# EAGLE board cyclops (EAGLE 8.3.2), part 1 of 2
PCB: Cyclops r3.1; REVISION: 3.1
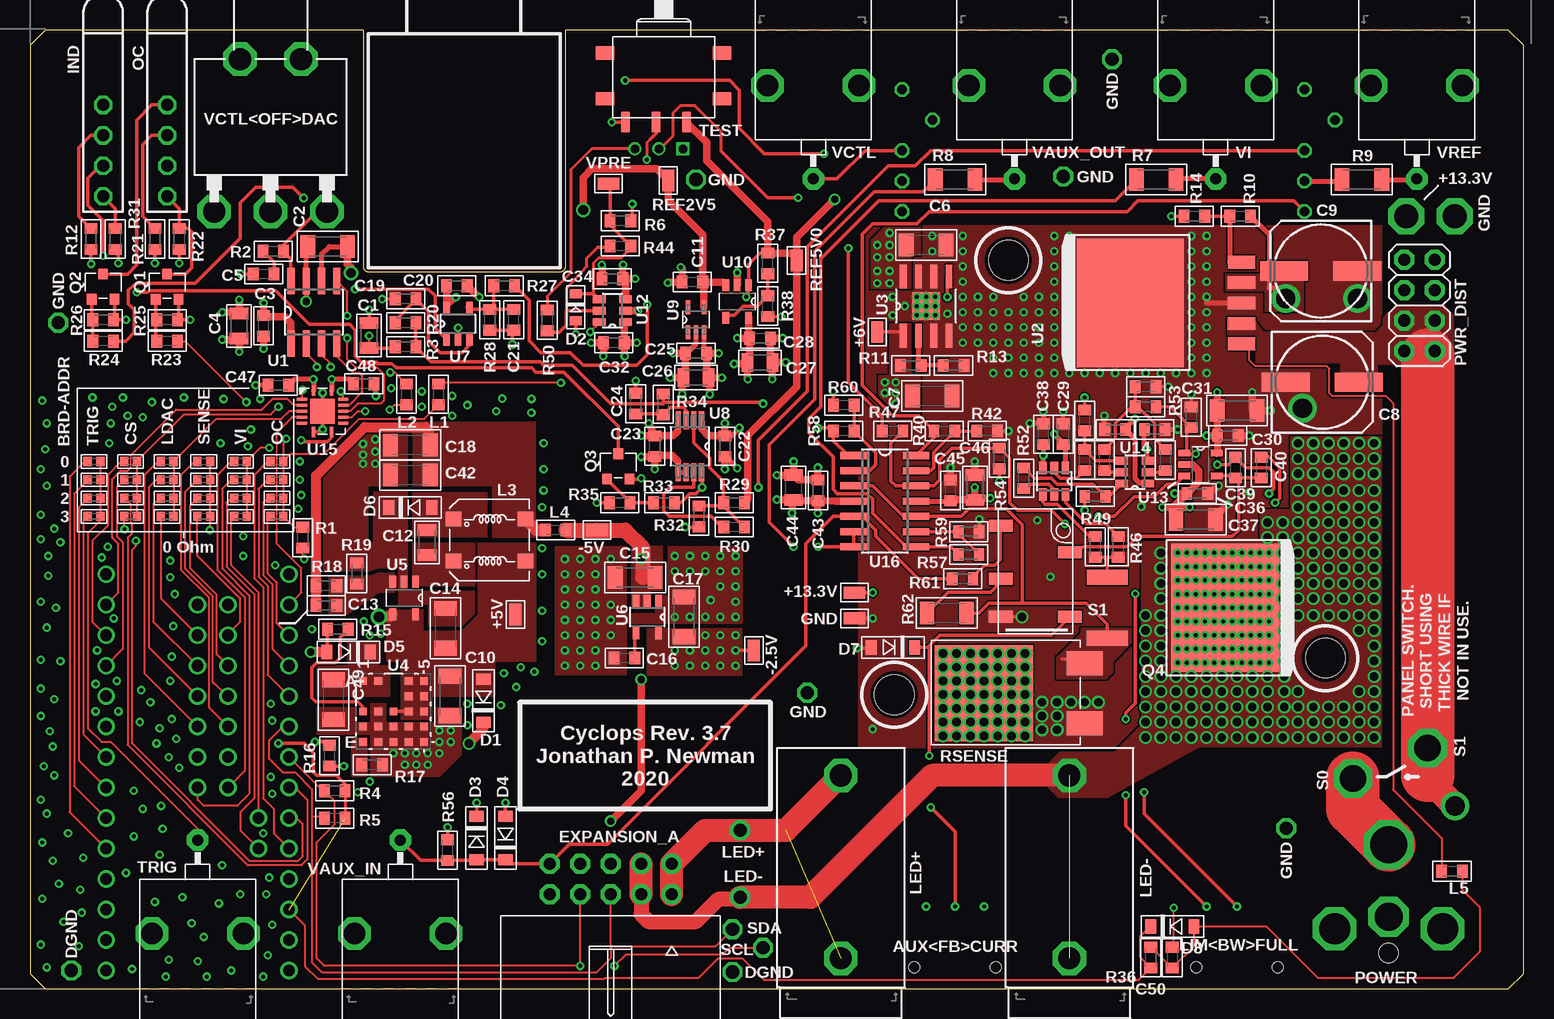
[diagram p5: board, top side]
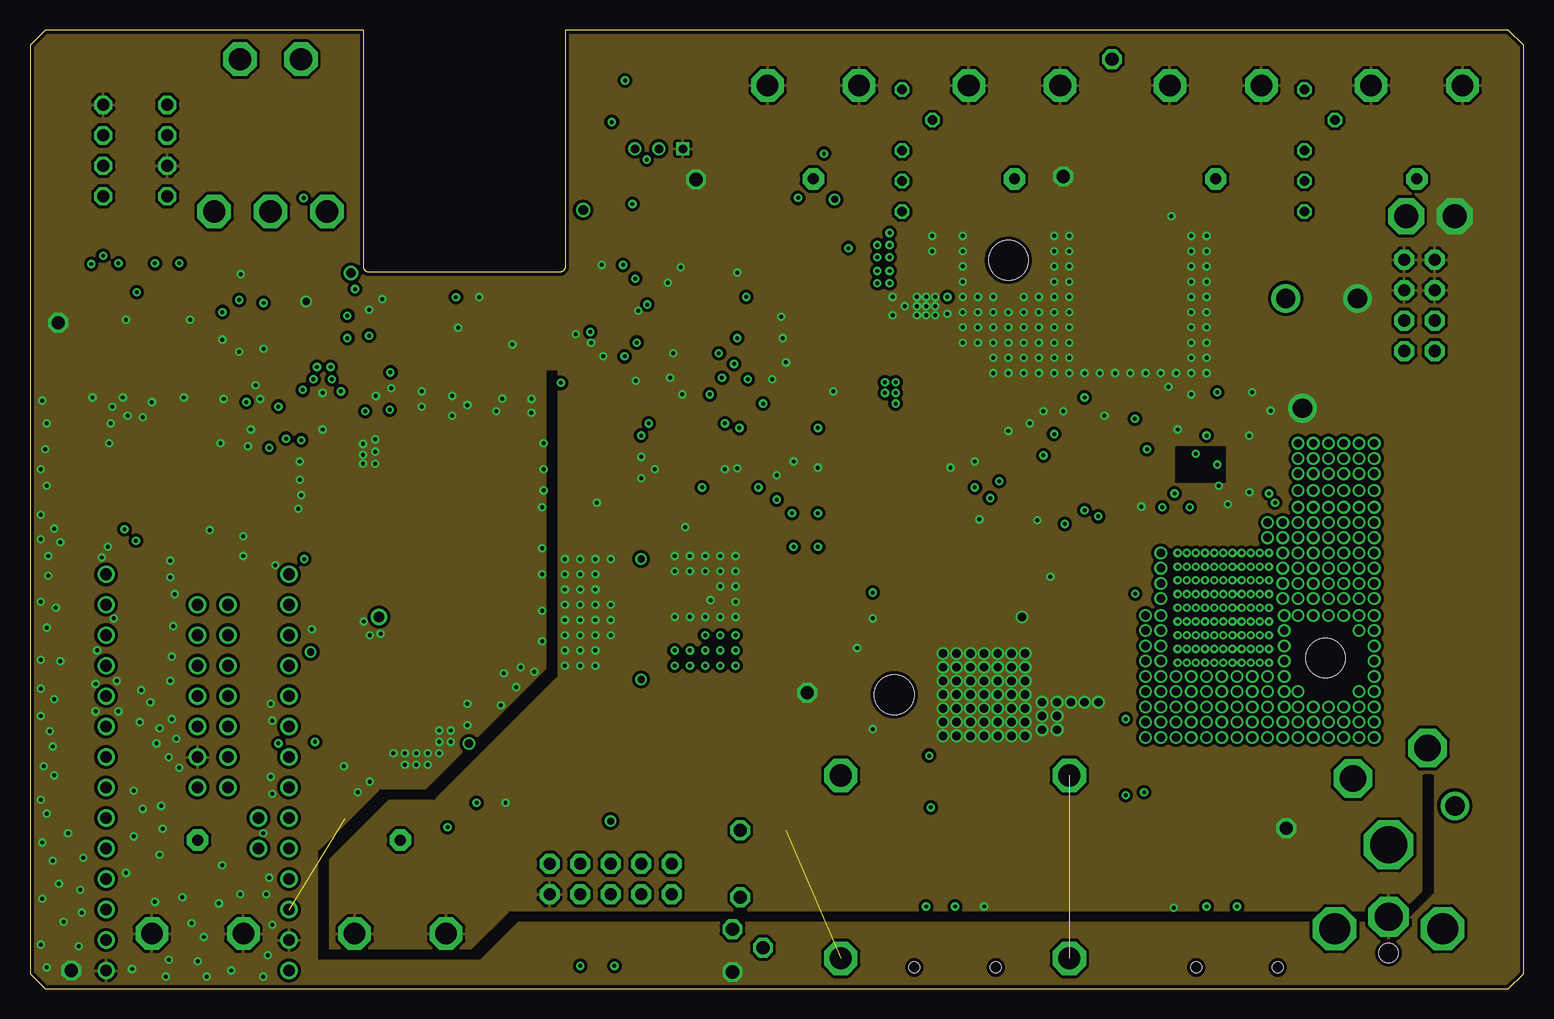
[diagram p6: board, inner layer Route2]
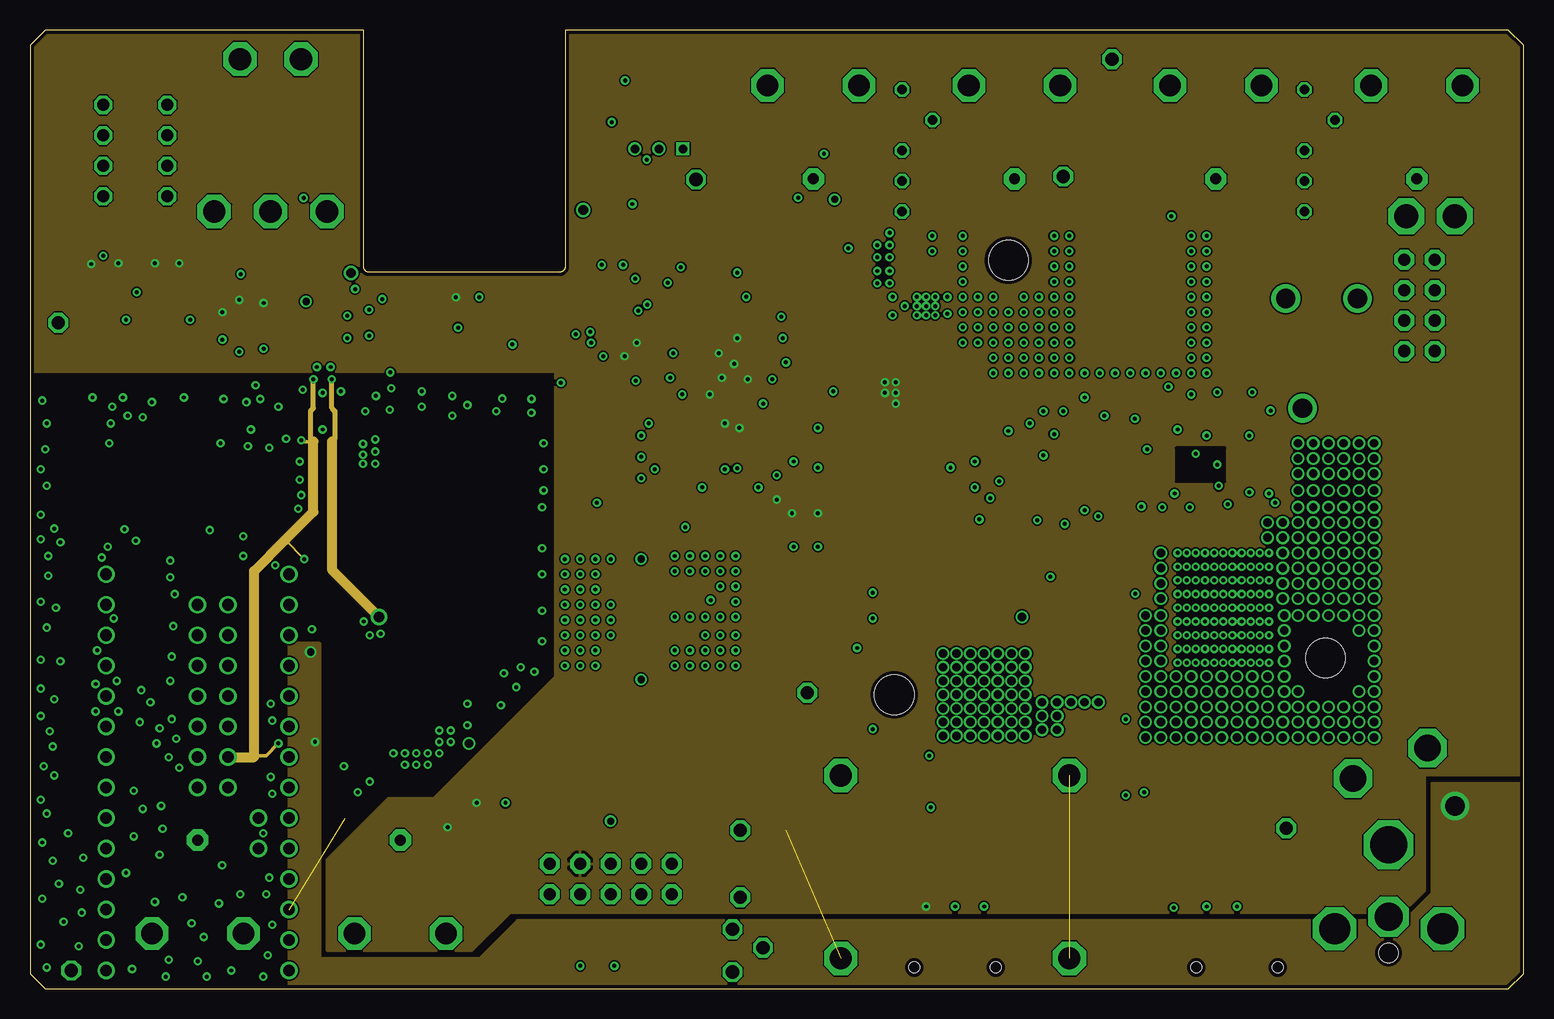
[diagram p7: board, inner layer Route15]
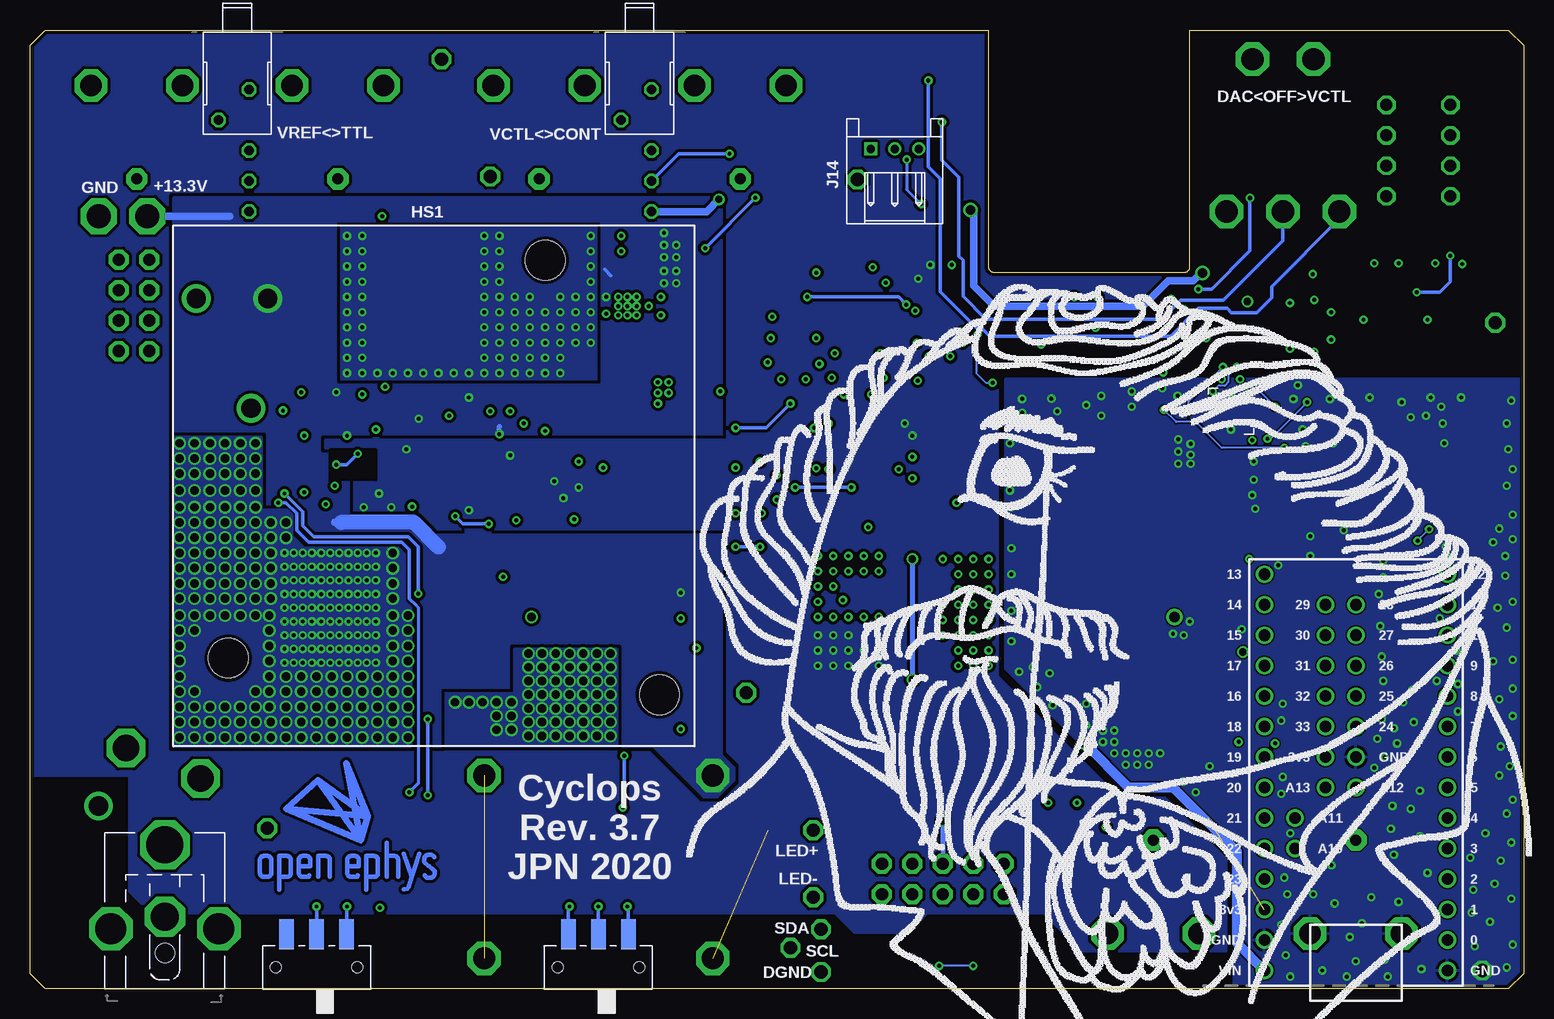
[diagram p8: board, bottom side, seen from below]

Size 124.46 x 79.9 mm. Coordinates in mm from the lower left corner, seen from the top.
Outline: 1.27,79.88 0,78.61 0,1.27 1.27,0 123.19,0 124.46,1.27 124.46,78.61 123.19,79.88 44.6,79.9 44.6,60.2 arc-90 44.1,59.7 28.3,59.7 arc-90 27.8,60.2 27.8,79.88 1.27,79.88
Copper layers (1+2*15+16): Top 0.0356mm / dielectric 1.5011mm / Route2 0.0356mm / dielectric 0.1499mm / Route15 0.0356mm / dielectric 0.2007mm / Bottom 0.0356mm
Design rules "circuit-hub-4-layer-low-cost *": minimum track width 5mil, minimum drill 13mil, track to track 5mil, track to pad 5mil, pad to pad 5mil, via to via 5mil, smd to smd 5mil, copper to edge 12mil, drill to drill 0.15mm, minimum pad ring 7mil, minimum via ring 7mil, stop-mask expansion 4mil, vias tented up to drill 100mil, thermal gap 10mil
Holes 3.3 mm at 72.01,24.51 81.53,60.71 107.95,27.56
tKeepout: area 0,0 to 2.5,80; area 122.4,0 to 125,80
bKeepout: area 122.4,0 to 125,80

## Footprints (pad centres in the part's own frame; a part is rotated, then mirrored left to right if it is on the bottom)
RC0603 = smd 1 x 1.8: 1 0,0
JS102011SAQN = smd 1.2 x 2.5: 1 -2.5,2.75; 2 0,2.75; 3 2.5,2.75 | hole 0.9: -3.4,0; 3.4,0
0805 = smd 0.965 x 1.524: 1 -1.041,0; 2 1.041,0
1206 = smd 1.219 x 1.88: 1 -1.651,0; 2 1.651,0
0603 = smd 0.889 x 1.067: 1 -0.864,0; 2 0.864,0
153CLV-0807 = smd 4 x 1.6: + 3.05,0; - -3.05,0
SOD123 = smd 0.914 x 1.219: A -1.8,0; C 1.8,0
SOD-323 = smd 0.762 x 1.016: A -1.118,0; C 1.118,0
2X05-IDC = drill 1.016 pad 1.676 octagon: 1 -5.08,-2.54; 2 -5.08,0; 3 -2.54,-2.54; 4 -2.54,0; 5 0,-2.54; 6 0,0; 7 2.54,-2.54; 8 2.54,0; 9 5.08,-2.54; 10 5.08,0
569-011X-X00_LED_ARRAY = drill 1.016 octagon: A1 -6.35,0; A2 -1.27,0; C1 -8.89,0; C2 -3.81,0
S3B-PH-K-S = drill 0.7 square: 1 0,2 | drill 0.7: 2 0,0; 3 0,-2
0402 = smd 0.686 x 0.762: 1 -0.533,0; 2 0.533,0
CLS62 = smd 1.3 x 1.2: 1 -3,1.75; 2 -3,-1.75; 3 3,-1.75; 4 3,1.75
A-2107 = drill 1.854 octagon: 1 0,0; 2 15.24,0
PJ-063BH = drill 3.1 octagon: 1 0,-12 | drill 2.35 octagon: 2 0,-6 | drill 2.6 octagon: M1 -4.5,-5.004; M2 4.5,-5.004 | hole 1.6: 0,-3
2X04-BIG = drill 1.016 pad 1.676 octagon: 1 -3.81,-1.27; 2 -3.81,1.27; 3 -1.27,-1.27; 4 -1.27,1.27; 5 1.27,-1.27; 6 1.27,1.27; 7 3.81,-1.27; 8 3.81,1.27
SOT23-GSD = smd 0.8 x 0.9: D 0,0; G -0.95,-2.1; S 0.95,-2.1
TO-262_01 = smd 10.668 x 9.017: D 0,4.508 | smd 1.27 x 3.429: G -2.54,-5.347; S 2.54,-5.347
TO-252-THICK-FILM = smd 2 x 3: 1 -2.5,-8.4; 2 2.5,-8.4 | smd 8 x 8.2: PAD 0,0
1462042 = smd 1 x 2: 1 0,-5.75; 3 5.4,-5.75; 5 7.6,0; 7 3.2,0; 8 0,0
CFPA = smd 1.7 x 0.7: 1 3.85,1.9; 2 3.85,-0.64; 3 3.85,-3.18 | smd 1.1 x 1.55: NC1 -1.905,4.875; NC2 -1.905,-4.875; NC3 1.905,-4.875; NC4 1.905,4.875
0731000105 = drill 0.914 pad 1.778 octagon: 1 0,12.395 | drill 1.803 octagon: 2 -3.81,4.597; 3 3.81,4.597
SO08 = smd 0.6 x 2.2: 1 -1.905,-2.6; 2 -0.635,-2.6; 3 0.635,-2.6; 4 1.905,-2.6; 5 1.905,2.6; 6 0.635,2.6; 7 -0.635,2.6; 8 -1.905,2.6
5-DDPAK = smd 1.067 x 2.286: 1 -3.404,-9.271; 2 -1.702,-9.271; 3 0,-9.271; 4 1.702,-9.271; 5 3.404,-9.271 | smd 10.668 x 8.89: TAB 0,0
SOIC127P600X175-9N = smd 1.981 x 0.559: 1 -2.464,1.905; 2 -2.464,0.635; 3 -2.464,-0.635; 4 -2.464,-1.905; 5 2.464,-1.905; 6 2.464,-0.635; 7 2.464,0.635; 8 2.464,1.905 | smd 2.286 x 2.286: 9 0,0
LGA21C127P5X5_625X625X242 = smd 0.635 x 0.635: A1 -2.54,2.54; A2 -1.27,2.54; A4 1.27,2.54; A5 2.54,2.54; B4 1.27,1.27; B5 2.54,1.27; C1 -2.54,0; C2 -1.27,0; C3 0,0; C4 1.27,0; C5 2.54,0; D1 -2.54,-1.27; D2 -1.27,-1.27; D3 0,-1.27; D4 1.27,-1.27; D5 2.54,-1.27; E1 -2.54,-2.54; E2 -1.27,-2.54; E3 0,-2.54; E4 1.27,-2.54; E5 2.54,-2.54
SOT95P310X175-5N = smd 1 x 0.55: 1 -1.35,0.95; 2 -1.35,0; 3 -1.35,-0.95; 4 1.35,-0.95; 5 1.35,0.95
SOT-23-5 = smd 0.55 x 1: 1 -0.95,-1.35; 2 0,-1.35; 3 0.95,-1.35; 4 0.95,1.35; 5 -0.95,1.35
SOP65P490X110-8N = smd 1.499 x 0.432: 1 -2.184,0.965; 2 -2.184,0.33; 3 -2.184,-0.33; 4 -2.184,-0.965; 5 2.184,-0.965; 6 2.184,-0.33; 7 2.184,0.33; 8 2.184,0.965
SOT65P210X110-5N = smd 1.168 x 0.356: 1 -1.041,0.66; 2 -1.041,0; 3 -1.041,-0.66; 4 1.041,-0.66; 5 1.041,0.66
SOT23-6 = smd 0.65 x 1.06: 1 -0.95,-1.1; 2 0,-1.1; 3 0.95,-1.1; 4 0.95,1.1; 5 0,1.1; 6 -0.95,1.1
14QFN_2X6_2X2 = smd 0.85 x 0.28: 1 -1.725,-0.75; 7 1.725,-0.75; 8 1.725,0.75; 14 -1.725,0.75 | smd 0.28 x 0.85: 2 -1,-1.725; 3 -0.5,-1.725; 4 0,-1.725; 5 0.5,-1.725; 6 1,-1.725; 9 1,1.725; 10 0.5,1.725; 11 0,1.725; 12 -0.5,1.725; 13 -1,1.725 | smd 2.05 x 2.05: PAD 0,0
SO14 = smd 0.6 x 2.2: 1 -3.81,-2.6; 2 -2.54,-2.6; 3 -1.27,-2.6; 4 0,-2.6; 5 1.27,-2.6; 6 2.54,-2.6; 7 3.81,-2.6; 8 3.81,2.6; 9 2.54,2.6; 10 1.27,2.6; 11 0,2.6; 12 -1.27,2.6; 13 -2.54,2.6; 14 -3.81,2.6
TEENSY_3.1_CYCLOPS = drill 0.965: 0 7.62,3.81; 1 7.62,6.35; 2 7.62,8.89; 3 7.62,11.43; 3.3V -7.62,6.35; 3.3V2 -2.54,19.05; 4 7.62,13.97; 5 7.62,16.51; 6 7.62,19.05; 7 7.62,21.59; 8 7.62,24.13; 9 7.62,26.67; 10 7.62,29.21; 11 7.62,31.75; 12 7.62,34.29; 13 -7.62,34.29; 14/A0 -7.62,31.75; 15/A1 -7.62,29.21; 16/A2 -7.62,26.67; 17/A3 -7.62,24.13; 18/A4 -7.62,21.59; 19/A5 -7.62,19.05; 20/A6 -7.62,16.51; 21/A7 -7.62,13.97; 22/A8 -7.62,11.43; 23/A9 -7.62,8.89; 24 0,21.59; 25 0,24.13; 26 0,26.67; 27 0,29.21; 28 0,31.75; 29 -2.54,31.75; 30 -2.54,29.21; 31 -2.54,26.67; 32 -2.54,24.13; 33 -2.54,21.59; A10 -5.08,11.43; A11 -5.08,13.97; A12 0,16.51; A13 -2.54,16.51; AGND -7.62,3.81; GND 7.62,1.27; GND2 0,19.05; VIN -7.62,1.27
AS12A*_SPDT = drill 0.8 octagon: MECH1 -10.16,0.991; MECH2 -7.62,-1.549; P1 0,0.991; P2 -2.54,0.991; P3 -5.08,0.991
2M1-SP1-T2-B4-M6RE = drill 1.854 octagon: 1 12.192,4.699; 2 12.192,0; 3 12.192,-4.699; M1 -0.508,-2.54; M2 -0.508,2.54

## Placement (x,y rotation side)
+5V  RCU-0C  [RC0603]  40.45,31.18 180 top
+6V  RCU-0C  [RC0603]  70.61,54.74 180 top
+13.3V  RCU-0C  [RC0603]  68.71,33.02 90 top
-2.5V  RCU-0C  [RC0603]  60.33,28.19 180 top
-5V  RCU-0C  [RC0603]  47.24,38.23 90 top
AUX<FB>CURR  JS102  [JS102011SAQN]  77.09,1.78 0 bottom
C1  1uF  [0805]  28.25,54.43 90 top
C2  10uF  [1206]  24.8,61.86 180 top
C3  .1uF  [0603]  19.46,55.24 270 top
C4  1uF  [0805]  17.42,55.24 270 top
C5  [0603]  19.47,59.56 180 top
C6  10uF  [1206]  74.68,61.98 0 top
C7  10uF  [1206]  75.18,49.4 0 top
C8  100uF  [153CLV-0807]  107.7,50.55 0 top
C9  100uF  [153CLV-0807]  107.57,59.82 180 top
C10  10uF  [1206]  35,24.4 270 top
C11  .1uF  [0603]  55.2,58.9 180 top
C12  1uF  [0805]  33.08,37.2 90 top
C13  220pF  [0603]  24.7,31.94 0 top
C14  4.7uF  [1206]  34.61,30.04 90 top
C15  10uF  [1206]  50.42,34.29 0 top
C16  10nF  [0603]  49.53,27.56 180 top
C17  10uF  [1206]  54.48,30.99 270 top
C18  10uF  [1206]  31.7,45.3 180 top
C19  .1uF  [0603]  31.3,57.5 180 top
C20  .1uF  [0603]  35.57,58.6 0 top
C21  .1uF  [0603]  40.3,55.75 270 top
C22  .1uF  [0603]  57.91,45.21 270 top
C23  .1uF  [0603]  52.07,45.21 270 top
C24  10nF  [0603]  50.48,48.77 90 top
C25  .1uF  [0603]  55.5,52.97 180 top
C26  1uF  [0805]  55.5,50.93 180 top
C27  1uF  [0805]  60.83,52.19 0 top
C28  .1uF  [0603]  60.83,54.22 0 top
C29  .1uF  [0603]  86.11,46.23 90 top
C30  .1uF  [0603]  99.82,46.1 0 top
C31  10uF  [1206]  100.58,48.19 0 top
C32  .1uF  [0603]  48.66,53.85 180 top
C33  .1uF  [0603]  93.73,46.61 0 top
C34  .1uF  [0603]  48.53,59.18 180 top
C35  .1uF  [0603]  90.42,46.61 180 top
C36  .1uF  [0603]  97.28,41.27 0 top
C37  10uF  [1206]  97.16,39.12 0 top
C38  .1uF  [0603]  84.45,46.23 90 top
C39  470pF  [0603]  100.46,43.43 90 top
C40  6.8nF  [0603]  102.62,43.43 90 top
C41  24pF  [0603]  92.96,50.16 0 top
C42  10uF  [1206]  31.7,42.8 180 top
C43  .1uF  [0603]  65.66,41.53 90 top
C44  1uF  [0805]  63.63,41.78 90 top
C45  .1uF  [0603]  76.71,41.53 90 top
C46  1uF  [0805]  78.74,41.78 90 top
C47  .1uF  [0603]  20.7,50.29 180 top
C48  .1uF  [0603]  27.81,50.42 0 top
C49  4.7uF  [1206]  25.3,24.1 270 top
C50  .1uF  [0603]  95.2,2.6 270 top
D1  1N5819  [SOD123]  37.78,24 270 top
D2  SZMM3Z5V1  [SOD-323]  45.48,56.8 90 top
D3  MBR0520L  [SOD123]  37.21,12.57 90 top
D4  MBR0520L  [SOD123]  39.62,12.57 270 top
D5  1N5819  [SOD123]  26.54,28.07 0 top
D6  MBR0520L  [SOD123]  31.69,40.11 180 top
D7  1N5819  [SOD123]  71.91,28.45 0 top
D8  1N5819  [SOD123]  95.2,5.2 180 top
EXPANSION_A  PINH2X5_ICD-H  [2X05-IDC]  48.39,7.87 180 top
GND  RCU-0C  [RC0603]  68.71,30.86 270 top
HS1  BDN17  [BDN17]  112.52,20.19 0 bottom
IND  569-0112-200  [569-011X-X00_LED_ARRAY]  6.1,64.77 270 top
J14  S3B-PH-K-S  [S3B-PH-K-S]  52.4,70 90 bottom
J_ADDR1  0  [0402]  14.48,43.94 180 top
J_ADDR2  0  [0402]  14.48,42.42 180 top
J_ADDR3  0  [0402]  14.48,40.89 180 top
J_ADDR4  0  [0402]  14.48,39.37 180 top
J_CS1  0  [0402]  8.38,43.94 180 top
J_CS2  0  [0402]  8.38,42.42 180 top
J_CS3  0  [0402]  8.38,40.89 0 top
J_CS4  0  [0402]  8.38,39.37 0 top
J_LDAC1  0  [0402]  11.43,43.94 0 top
J_LDAC2  0  [0402]  11.43,42.42 180 top
J_LDAC3  0  [0402]  11.43,40.89 180 top
J_LDAC4  0  [0402]  11.43,39.37 180 top
J_OC1  0  [0402]  20.57,43.94 0 top
J_OC2  0  [0402]  20.57,42.42 0 top
J_OC3  0  [0402]  20.57,40.89 0 top
J_OC4  0  [0402]  20.57,39.37 0 top
J_T1  0  [0402]  5.33,43.94 0 top
J_T2  0  [0402]  5.33,42.42 0 top
J_T3  0  [0402]  5.33,40.89 0 top
J_T4  0  [0402]  5.33,39.37 0 top
J_VI1  0  [0402]  17.53,43.94 180 top
J_VI2  0  [0402]  17.53,42.42 180 top
J_VI3  0  [0402]  17.53,40.89 180 top
J_VI4  0  [0402]  17.53,39.37 180 top
L1  MPZ1608  [0603]  34.04,49.53 270 top
L2  MPZ1608  [0603]  31.37,49.53 90 top
L3  10uH  [CLS62]  38.29,37.4 0 top
L4  MPZ1608  [0603]  43.81,38.23 0 top
L5  MPZ1608  [0603]  118.5,9.8 180 top
LED+  24.243.1  [A-2107]  67.56,2.54 90 top
LED-  24.243.2  [A-2107]  86.61,2.54 90 top
LIM<BW>FULL  JS102  [JS102011SAQN]  100.58,1.78 0 bottom
OC  569-0111-100  [569-011X-X00_LED_ARRAY]  11.43,64.77 270 top
POWER  PJ-063BH  [PJ-063BH]  113.22,0 180 bottom
PWR_DIST  SSQ-104-03-G-D  [2X04-BIG]  115.8,56.95 90 top
Q1  NDS351AN  [SOT23-GSD]  11.43,59.56 0 top
Q2  NDS351AN  [SOT23-GSD]  6.1,59.56 0 top
Q3  NDS351AN  [SOT23-GSD]  49.02,44.58 0 top
Q4  IRF510  [TO-262_01]  95.12,31.75 270 top
R1  10k  [0603]  22.73,37.59 270 top
R2  [0603]  20.27,61.47 0 top
R3  100k  [0603]  31.3,53.5 180 top
R4  10k  [0603]  25.4,16.51 180 top
R5  10k  [0603]  25.4,14.22 180 top
R6  100  [0603]  49.2,64 180 top
R7  50  [1206]  93.85,67.44 180 top
R8  50  [1206]  77.09,67.44 180 top
R9  50  [1206]  111,67.44 180 top
R10  10k  [0603]  100.84,64.39 0 top
R11  33k  [0603]  73.41,51.94 180 top
R12  1k  [0603]  5.08,62.48 270 top
R13  4.7k  [0603]  76.96,51.94 180 top
R14  1k  [0603]  97.03,64.39 0 top
R15  100k  [0603]  25.65,29.97 180 top
R16  1M  [0603]  24.96,19.43 270 top
R17  165k  [0603]  28.51,18.67 180 top
R18  29.4k  [0603]  24.7,33.59 180 top
R19  10k  [0603]  27.24,34.61 270 top
R20  10k  [0603]  31.3,55.5 0 top
R21  1k  [0603]  10.41,62.48 270 top
R22  1k  [0603]  12.45,62.48 270 top
R23  1k  [0603]  11.43,53.98 0 top
R24  1k  [0603]  6.1,53.98 0 top
R25  100k  [0603]  11.43,55.75 180 top
R26  100k  [0603]  6.1,55.75 180 top
R27  40k  [0603]  39.51,58.6 180 top
R28  10k  [0603]  38.31,55.75 270 top
R29  100k  [0603]  58.67,40.51 0 top
R30  100k  [0603]  58.67,38.48 180 top
R31  1k  [0603]  7.11,62.48 270 top
R32  100  [0603]  55.75,39.37 90 top
R33  1k  [0603]  52.83,40.51 0 top
R34  100  [0603]  52.77,48.7 270 top
R35  100k  [0603]  49.15,40.51 0 top
R36  1M  [0603]  93.4,2.6 90 top
R37  1k  [0603]  61.47,60.45 270 top
R38  1k  [0603]  61.47,56.9 270 top
R40  0  [0603]  76.2,46.48 180 top
R41  1k  [0603]  87.88,47.37 270 top
R42  [0603]  79.76,46.48 0 top
R43  0  [0603]  87.88,44.07 270 top
R44  0  [0603]  49.2,61.9 0 top
R45  100  [0603]  89.53,44.07 270 top
R46  0.5  [0603]  90.68,36.83 270 top
R47  1k  [0603]  71.88,46.48 0 top
R48  200  [0603]  92.96,48.51 180 top
R49  0.5  [0603]  88.77,36.83 270 top
R50  2.1k  [0603]  43.1,55.7 270 top
R51  10  [0603]  94.61,44.07 270 top
R52  0  [0603]  82.8,42.55 270 top
R53  470  [0603]  96.77,47.62 270 top
R54  1M  [0603]  80.77,44.2 90 top
R55  1k  [0603]  88.77,41.02 180 top
R56  165k  [0603]  34.8,11.56 90 top
R57  0  [0603]  78.22,36.2 180 top
R58  0  [0603]  67.82,46.48 180 top
R59  [0603]  78.22,38.1 0 top
R60  [0603]  67.82,48.64 180 top
R61  0  [0603]  77.72,34.16 180 top
R62  50  [1206]  76.4,31.3 180 top
REF2V5  RCU-0C  [RC0603]  53.18,67.37 0 top
REF5V0  RCU-0C  [RC0603]  63.88,60.7 180 top
RSENSE  1R0,10W  [TO-252-THICK-FILM]  79.5,24.64 90 top
S1  1462042-8  [1462042]  80.9,30.99 90 top
TEST  CFPA  [CFPA]  52.81,76.07 270 top
TRIG  0731000105  [0731000105]  13.97,0 0 top
U1  MCP4921  [SO08]  23.65,56.39 0 top
U2  LT1764A  [5-DDPAK]  91.69,57.15 90 top
U3  BD00FC0WEFJ  [SOIC127P600X175-9N]  74.68,56.9 90 top
U4  LTM8020  [LGA21C127P5X5_625X625X242]  30.29,23.11 0 top
U5  LT1931  [SOT95P310X175-5N]  31.18,32.58 270 top
U6  TPS72325  [SOT-23-5]  51.44,30.99 180 top
U7  TLV3701  [SOT-23-5]  35.67,55.42 0 top
U8  LT1711  [SOP65P490X110-8N]  54.99,45.21 270 top
U9  ADR03  [SOT65P210X110-5N]  55.5,55.76 90 top
U10  LT1880  [SOT95P310X175-5N]  58.93,57.28 270 top
U11  ZXTD  [SOT23-6]  85.34,42.29 180 top
U12  ADG1201  [SOT23-6]  48.53,56.52 90 top
U13  THS4281  [SOT95P310X175-5N]  97.54,43.69 0 top
U14  ZXTD  [SOT23-6]  92.08,43.05 90 top
U15  TXB0104RGYR  [14QFN_2X6_2X2]  24.38,48.13 270 top
U16  OPA1664  [SO14]  71.24,40.64 270 top
U$56  [CYCLOPS_LOGO]  38.81,21.75 0 bottom
UC  TEENSY_3.2  [TEENSY_3.1_CYCLOPS]  13.97,0.25 0 bottom
VAUX_IN  0731000105  [0731000105]  30.86,0 0 top
VAUX_OUT  0731000105  [0731000105]  82.04,79.88 180 top
VCTL  0731000105  [0731000105]  65.28,79.88 180 top
VCTL<>CONT  AS12CV  [AS12A*_SPDT]  73.66,64.77 270 bottom
VCTL<OFF>DAC  100-SP3  [2M1-SP1-T2-B4-M6RE]  20.05,76.96 270 top
VI  0731000105  [0731000105]  98.81,79.88 180 top
VPRE  TPTP16R  [RC0603]  48.2,67.1 90 top
VREF  0731000105  [0731000105]  115.57,79.88 180 top
VREF<>TTL  AS12CV  [AS12A*_SPDT]  107.19,64.77 270 bottom
X1  OE-LOGO_14X10  [OE-LOGO-14X10]  98.7,12 0 bottom